# Altium schematic sheet nm_mem.SchDoc: =GlobalProjectName
size 209 x 297 mm; SheetNumber: 5; SheetTotal: 9; PageSetup: Record=PageOptions|CenterHorizontal=True|CenterVertical=True|PrintScale=1.00|XCorrection=1.00|YCorrection=1.00|PrintKind=1|BorderSize=5000000|LeftOffset=0|BottomOffset=0|Orientation=2|PaperLength=1000|PaperWidth=1000|Scale=100|PaperSource=15|PrintQuality=1200|MediaType=1|DitherType=10|PaperKind=A3|PrintScaleMode=1; Weight: -; ScaleFactor: -
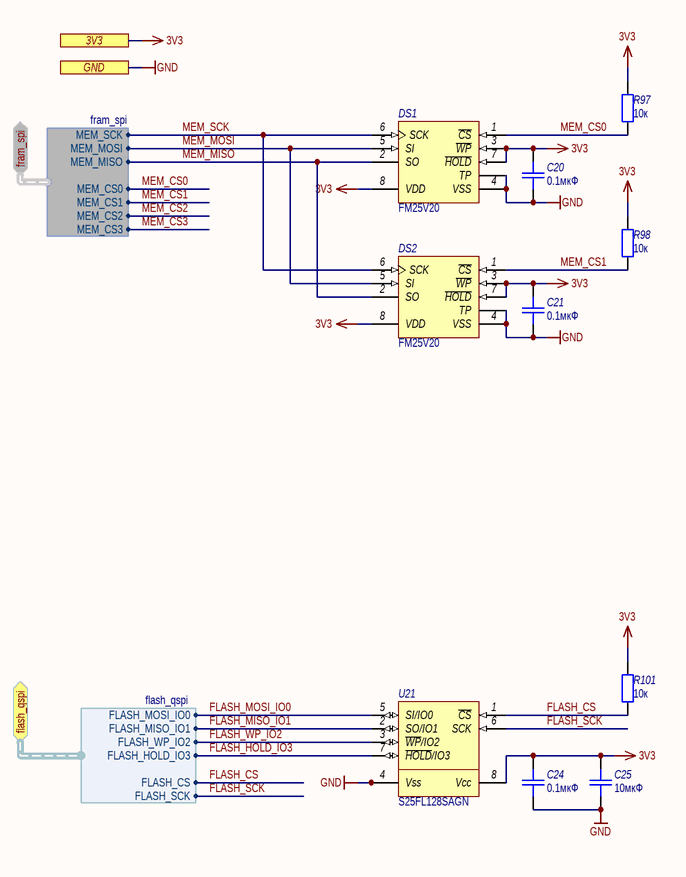
[diagram p0: nm_mem.SchDoc]

## Parts
C20  0.1мкФ  [SMD_C0603]
C21  0.1мкФ  [SMD_C0603]
C24  0.1мкФ  [SMD_C0603]
C25  10мкФ  [SMD_C0603]
DS1  FM25V20  [TDFN-8_6x5]
DS2  FM25V20  [TDFN-8_6x5]
R97  value 10к  [SMD_0603]  (hidden comment: Resistor)
R98  value 10к  [SMD_0603]  (hidden comment: Resistor)
R101  value 10к  [SMD_0603]  (hidden comment: Resistor)
U21  S25FL128SAGN  [WSON-8_6x8]

## Ports
3V3, flash_qspi (bidir, harness flash_qspi), fram_spi (bidir, harness fram_spi), GND

## Harnesses
fram_spi: MEM_SCK, MEM_MOSI, MEM_MISO, MEM_CS0, MEM_CS1, MEM_CS2, MEM_CS3
flash_qspi: FLASH_MOSI_IO0, FLASH_MISO_IO1, FLASH_WP_IO2, FLASH_HOLD_IO3, FLASH_CS, FLASH_SCK

## Nets
3V3: C20.2 C21.2 C24.2 C25.2 DS1.3(~{WP}) DS1.7(~{HOLD}) DS1.8(VDD) DS2.3(~{WP}) DS2.7(~{HOLD}) DS2.8(VDD) R97.1 R98.1 R101.1 U21.8(Vcc) ; port 3V3
GND: C20.1 C21.1 C24.1 C25.1 DS1.4(VSS) DS1.TP DS2.4(VSS) DS2.TP U21.4(Vss) U21.9(TP) ; port GND
FLASH_CS: R101.2 U21.1(~{CS}) ; port flash_qspi.FLASH_CS
FLASH_HOLD_IO3: U21.7(~{HOLD}/IO3) ; port flash_qspi.FLASH_HOLD_IO3
FLASH_MISO_IO1: U21.2(SO/IO1) ; port flash_qspi.FLASH_MISO_IO1
FLASH_MOSI_IO0: U21.5(SI/IO0) ; port flash_qspi.FLASH_MOSI_IO0
FLASH_SCK: U21.6(SCK) ; port flash_qspi.FLASH_SCK
FLASH_WP_IO2: U21.3(~{WP}/IO2) ; port flash_qspi.FLASH_WP_IO2
MEM_CS0: DS1.1(~{CS}) R97.2 ; port fram_spi.MEM_CS0
MEM_CS1: DS2.1(~{CS}) R98.2 ; port fram_spi.MEM_CS1
MEM_CS2: port fram_spi.MEM_CS2
MEM_CS3: port fram_spi.MEM_CS3
MEM_MISO: DS1.2(SO) DS2.2(SO) ; port fram_spi.MEM_MISO
MEM_MOSI: DS1.5(SI) DS2.5(SI) ; port fram_spi.MEM_MOSI
MEM_SCK: DS1.6(SCK) DS2.6(SCK) ; port fram_spi.MEM_SCK

## Notes on the sheet
- Подп. и дата
- Инв. № дубл.
- Взам. инв. №
- Инв. № подл.
- Изм.
- Лист
- № докум.
- Подп.
- Дата
- Форма 2а ГОСТ 2.104-2006
- Копировал
- Формат А4

## Library data of the parts
C20 C21 C24 C25 = Capacitor: Назначение: SMD-конденсатор; Наименование: Конденсатор; Потребление, Вт: 0; Place_v1: *; Place_v2: *
  C20 C21 C24: Value: 0.1мкФ
  C25: Value: 10мкФ
DS1 DS2 = FM25V: 2Mb Serial 3V FRAM Memory; Потребление, Вт: 0,009; Назначение: 2Mb Serial 3V FRAM Memory; ComponentLink1Description: Datasheet; ComponentLink1URL: https://www.cypress.com/file/136456/download; Наименование: FM25V20; Place_v1: *; Place_v2: *
R97 R98 R101 = Resistor: Наименование: Резистор; Назначение: SMD-резистор; Потребление, Вт: 0,001; Точность: %; Place_v1: *; Place_v2: *
U21 = S25FL128SAGN: Programmable NOR flash memory; Потребление, Вт: 0.1; Назначение: Programmable NOR flash memory; ComponentLink1Description: DataSheet; ComponentLink1URL: https://www.infinite-electronic.ru/datasheet/8b-S25FL256SAGBHV203.pdf; Supplier 1: Digi-Key; Supplier Part Number 1: 428-4618-ND; Наименование: S25FL128SAGN; Place_v1: *; Place_v2: *